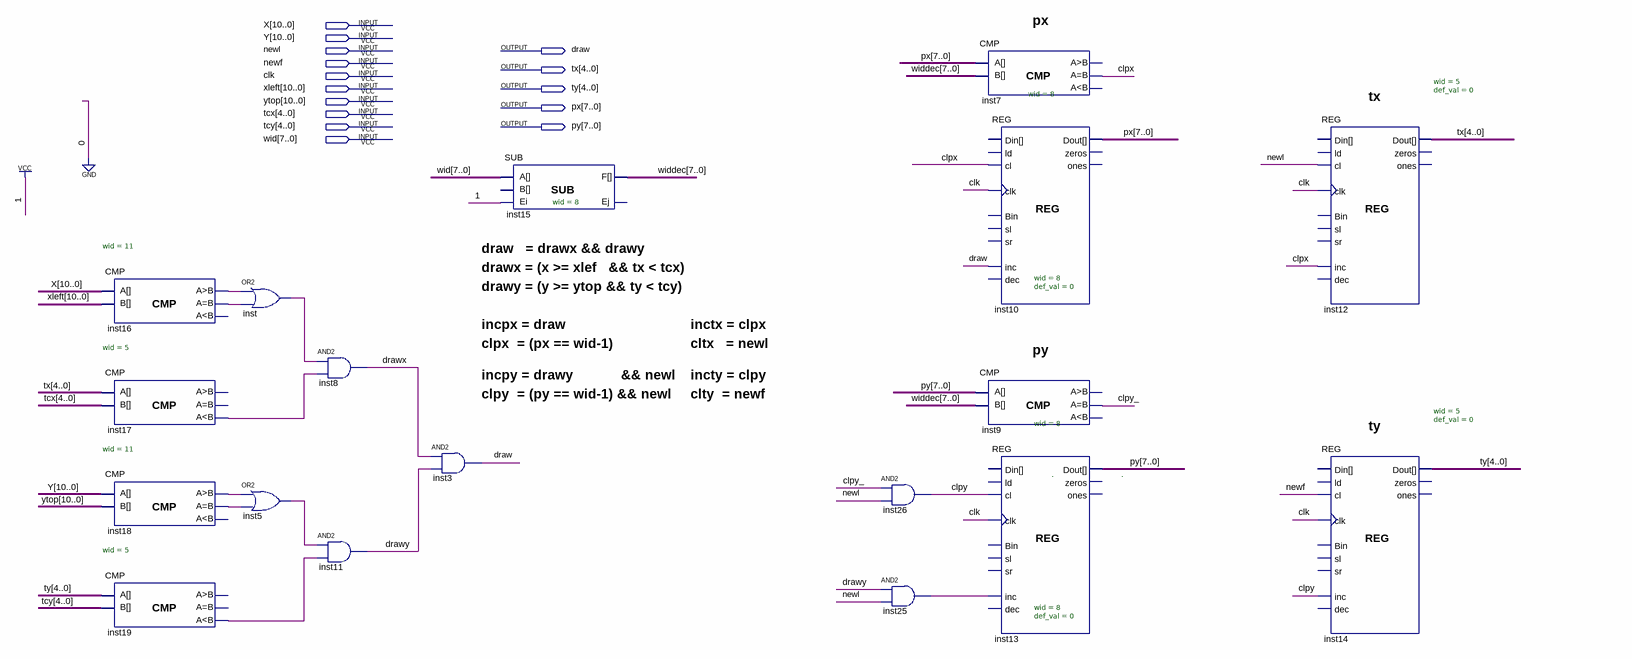
[diagram p0: schematic sheet]
// Quartus schematic Layer.bdf as structural Verilog: 18 symbols, 15 pins
module Layer (
  input  [10:0] X,
  input  [10:0] Y,
  input  newl,
  input  newf,
  input  clk,
  input  [10:0] xleft,
  input  [10:0] ytop,
  input  [4:0] tcx,
  input  [4:0] tcy,
  input  [7:0] wid,
  output draw,
  output [4:0] tx,
  output [4:0] ty,
  output [7:0] px,
  output [7:0] py
);

  wire clpx, clpy, clpy_, drawx, drawy, inst5_out, inst16_eq, inst16_gr, inst17_ls, inst18_eq, inst18_gr,
       inst19_ls, inst25_out, inst_out;
  wire [7:0] widdec;

  CMP #(.wid(11)) inst16 (.A(X), .B(xleft), .gr(inst16_gr), .eq(inst16_eq));  // open: ls
  CMP #(.wid(5)) inst17 (.A(tx), .B(tcx), .ls(inst17_ls));  // open: gr, eq
  CMP #(.wid(11)) inst18 (.A(Y), .B(ytop), .gr(inst18_gr), .eq(inst18_eq));  // open: ls
  CMP #(.wid(5)) inst19 (.A(ty), .B(tcy), .ls(inst19_ls));  // open: gr, eq
  or inst (inst_out, inst16_gr, inst16_eq);
  or inst5 (inst5_out, inst18_gr, inst18_eq);
  and inst8 (drawx, inst_out, inst17_ls);
  and inst11 (drawy, inst5_out, inst19_ls);
  and inst3 (draw, drawx, drawy);
  SUB #(.wid(8)) inst15 (.A(wid), .Ei(1'b1), .F(widdec));  // open: B, Ej
  and inst26 (clpy, clpy_, newl);
  and inst25 (inst25_out, drawy, newl);
  CMP #(.wid(8)) inst7 (.A(px), .B(widdec), .eq(clpx));  // open: gr, ls
  REG #(.wid(8), .def_val(0)) inst10 (
    .cl(clpx), .clk(clk), .inc(draw), .Dout(px));  // open: ld, Bin, sl, sr, dec, Din, zeros, ones
  CMP #(.wid(8)) inst9 (.A(py), .B(widdec), .eq(clpy_));  // open: gr, ls
  REG #(.wid(8), .def_val(0)) inst13 (
    .cl(clpy), .clk(clk), .inc(inst25_out), .Dout(py));  // open: ld, Bin, sl, sr, dec, Din, zeros, ones
  REG #(.wid(5), .def_val(0)) inst12 (
    .cl(newl), .clk(clk), .inc(clpx), .Dout(tx));  // open: ld, Bin, sl, sr, dec, Din, zeros, ones
  REG #(.wid(5), .def_val(0)) inst14 (
    .cl(newf), .clk(clk), .inc(clpy), .Dout(ty));  // open: ld, Bin, sl, sr, dec, Din, zeros, ones

  // Notes on the sheet:
  //   px
  //   tx
  //   draw   = drawx && drawy
  //   drawx = (x >= xlef   && tx < tcx)
  //   drawy = (y >= ytop && ty < tcy)
  //   incpx = draw
  //   inctx = clpx
  //   clpx  = (px == wid-1)
  //   cltx   = newl
  //   py
  //   incpy = drawy            && newl
  //   incty = clpy
  //   clpy  = (py == wid-1) && newl
  //   clty  = newf
  //   ty
  //   .
  //   .
endmodule
